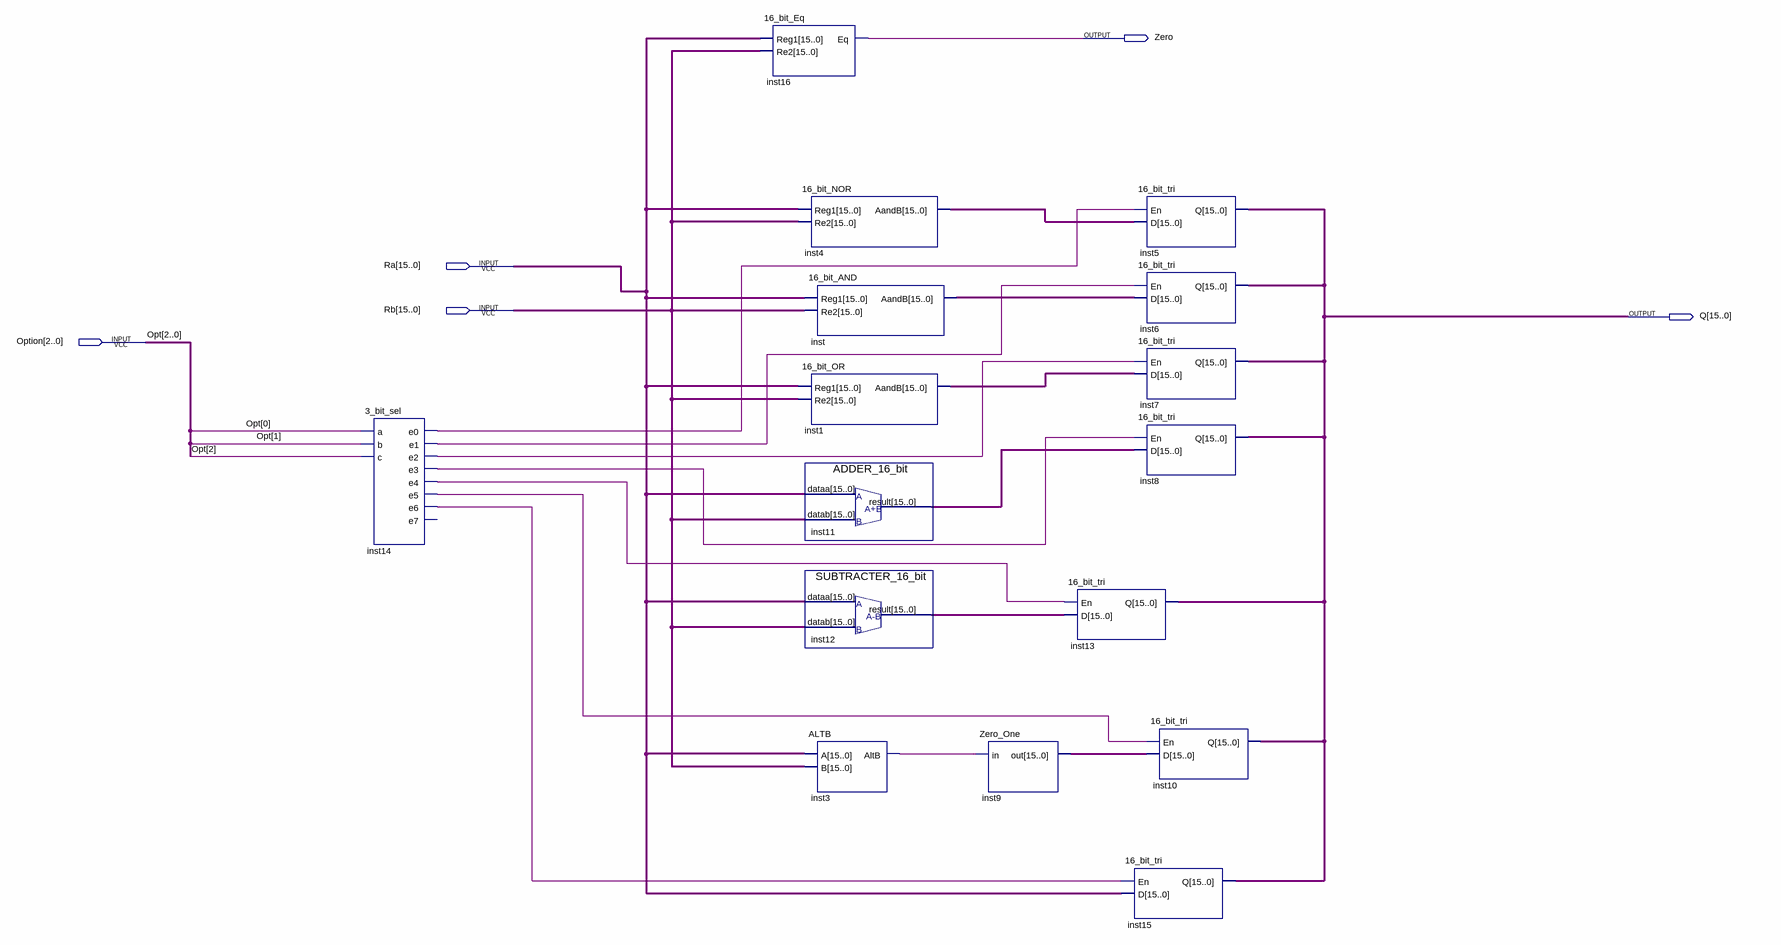
[diagram p0: schematic sheet]
// Quartus schematic ALU_2.bdf as structural Verilog: 16 symbols, 5 pins
module ALU_2 (
  input  [15:0] Ra,
  input  [15:0] Rb,
  input  [2:0] Option,
  output Zero,
  output [15:0] Q
);

  wire inst3_altb, inst14_e0, inst14_e1, inst14_e2, inst14_e3, inst14_e4, inst14_e5, inst14_e6;
  wire [15:0] inst1_aandb, inst4_aandb, inst9_out, inst11_result, inst12_result, inst_aandb;

  \3_bit_sel  inst14 (
    .a(Option[0]), .b(Option[1]), .c(Option[2]), .e0(inst14_e0), .e1(inst14_e1), .e2(inst14_e2),
    .e3(inst14_e3), .e4(inst14_e4), .e5(inst14_e5), .e6(inst14_e6));  // open: e7
  \16_bit_Eq  inst16 (.Reg1(Ra), .Re2(Rb), .Eq(Zero));
  \16_bit_NOR  inst4 (.Reg1(Ra), .Re2(Rb), .AandB(inst4_aandb));
  \16_bit_AND  inst (.Reg1(Ra), .Re2(Rb), .AandB(inst_aandb));
  \16_bit_OR  inst1 (.Reg1(Ra), .Re2(Rb), .AandB(inst1_aandb));
  ADDER_16_bit inst11 (.dataa(Ra), .datab(Rb), .result(inst11_result));
  SUBTRACTER_16_bit inst12 (.dataa(Ra), .datab(Rb), .result(inst12_result));
  ALTB inst3 (.A(Ra), .B(Rb), .AltB(inst3_altb));
  Zero_One inst9 (.in(inst3_altb), .out(inst9_out));
  \16_bit_tri  inst13 (.En(inst14_e4), .D(inst12_result), .Q(Q));
  \16_bit_tri  inst5 (.En(inst14_e0), .D(inst4_aandb), .Q(Q));
  \16_bit_tri  inst6 (.En(inst14_e1), .D(inst_aandb), .Q(Q));
  \16_bit_tri  inst7 (.En(inst14_e2), .D(inst1_aandb), .Q(Q));
  \16_bit_tri  inst8 (.En(inst14_e3), .D(inst11_result), .Q(Q));
  \16_bit_tri  inst10 (.En(inst14_e5), .D(inst9_out), .Q(Q));
  \16_bit_tri  inst15 (.En(inst14_e6), .D(Ra), .Q(Q));

  // Other names for the same wires on the sheet: Opt[2:0] = Option
endmodule
